# EAGLE design jussi (EAGLE 7.5.0)
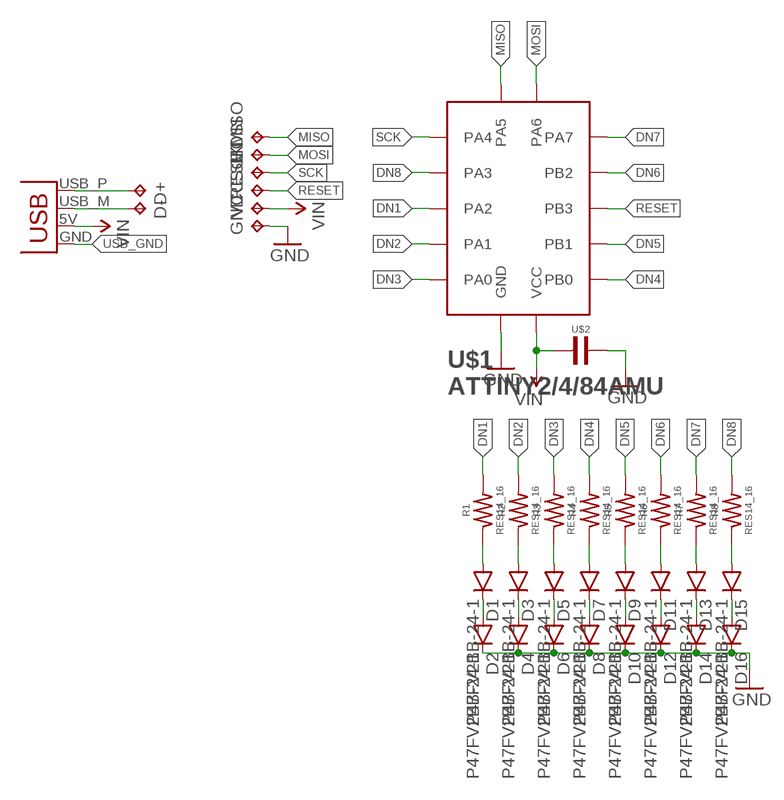
[diagram p0: schematic, sheet 1]

## Parts
D1  P47FV2BB-24-1  [P47F]
D2  P47FV2BB-24-1  [P47F]
D3  P47FV2BB-24-1  [P47F]
D4  P47FV2BB-24-1  [P47F]
D5  P47FV2BB-24-1  [P47F]
D6  P47FV2BB-24-1  [P47F]
D7  P47FV2BB-24-1  [P47F]
D8  P47FV2BB-24-1  [P47F]
D9  P47FV2BB-24-1  [P47F]
D10  P47FV2BB-24-1  [P47F]
D11  P47FV2BB-24-1  [P47F]
D12  P47FV2BB-24-1  [P47F]
D13  P47FV2BB-24-1  [P47F]
D14  P47FV2BB-24-1  [P47F]
D15  P47FV2BB-24-1  [P47F]
D16  P47FV2BB-24-1  [P47F]
D+  TPTP08R  [TP08R]
D-  TPTP08R  [TP08R]
GND  TPTP08R  [TP08R]
JP1  USBPCB  [USB-A-PCB]
MISO  TPTP08R  [TP08R]
MOSI  TPTP08R  [TP08R]
R1  RES14_16  [0402]
R2  RES14_16  [0402]
R3  RES14_16  [0402]
R4  RES14_16  [0402]
R5  RES14_16  [0402]
R6  RES14_16  [0402]
R7  RES14_16  [0402]
R8  RES14_16  [0402]
RESET  TPTP08R  [TP08R]
SCK  TPTP08R  [TP08R]
U$1  ATTINY2/4/84AMU  [20-WFQFN]
U$2  CAP47UF_10V  [0805]
VCC  TPTP08R  [TP08R]

## Nets
D+: D+.TP JP1.USB_P(D+)
D-: D-.TP JP1.USB_M(D-)
DN1: R1.2 U$1.3(PA2)
DN2: R2.2 U$1.4(PA1)
DN3: R3.2 U$1.5(PA0)
DN4: R4.2 U$1.11(PB0)
DN5: R5.2 U$1.12(PB1)
DN6: R6.2 U$1.14(PB2)
DN7: R7.2 U$1.15(PA7)
DN8: R8.2 U$1.2(PA3)
GND: D2.C D4.C D6.C D8.C D10.C D12.C D14.C D16.C GND.TP U$1.8(GND) U$1.PAD(GND) U$2.2
MISO: MISO.TP U$1.20(PA5)
MOSI: MOSI.TP U$1.16(PA6)
N$1: D1.C D2.A
N$2: D3.C D4.A
N$3: D5.C D6.A
N$4: D7.C D8.A
N$5: D9.C D10.A
N$6: D11.C D12.A
N$7: D13.C D14.A
N$8: D15.C D16.A
N$9: D1.A R1.1
N$10: D3.A R2.1
N$11: D5.A R3.1
N$12: D7.A R4.1
N$13: D9.A R5.1
N$14: D11.A R6.1
N$15: D13.A R7.1
N$16: D15.A R8.1
RESET: RESET.TP U$1.13(PB3)
SCK: SCK.TP U$1.1(PA4)
USB_GND: JP1.GND
VIN: JP1.5V(VBUS) U$1.9(VCC) U$2.1 VCC.TP

## Library data of the parts
D1-D16 = pcb-card:P47F: PointLED® Enhanced Thinfilm LED; DIGIKEY_PART_#: 475-1301-1-ND; EURO: 7.74/25; MANUFACTURER: OSRAM Opto Semiconductors Inc.; MFG_PART_#: LA P47F-V2BB-24-3A4B-Z
D+ D- GND MISO MOSI RESET SCK VCC = testpad:TP: Test pad
JP1 = SparkFun-Connectors:USB: USB Connectors USB-B-PTH is fully proven SKU : PRT-00139/CONN-08278 USB-miniB is fully proven SKU : PRT-00587 USB-A-PCB is untested. USB-A-H is throughly reviewed, but untested. Spark Fun Electronics SKU : PRT-00437 USB-B-SMT is throughly reviewed, but untested. Needs silkscreen touching up. USB-A-S has not been used/tested USB-MB-H has not been used/tested USB-MICROB has been used. CONN-09505
R1-R8 = dubec:RES: Resistor; DIGIKEY_PART_#: 541-14.0LCT-ND; EURO: 2.09/50; MANUFACTURER: Vishay Dale; MFG_PART_#: CRCW040214R0FKED; TEMP: ±100ppm/°C; TOLERANCE: ±1%
U$1 = pcb-card:ATTINY2/4/84A: ATtiny24A/44A/84A; DIGIKEY_PART_#: ATTINY24A-MU-ND; EURO: 12.11/10; MANUFACTURER: Atmel; MFG_PART_#: ATTINY24A-MU
U$2 = dubec:CAP: Ceramic capacitor; DIGIKEY_PART_#: 445-8239-1-ND; MANUFACTURER: TDK Corporation; MFG_PART_#: C2012X5R1A476M125AC; TEMP: X5R; TOLERANCE: ±20%; USD: 0.93

## Board
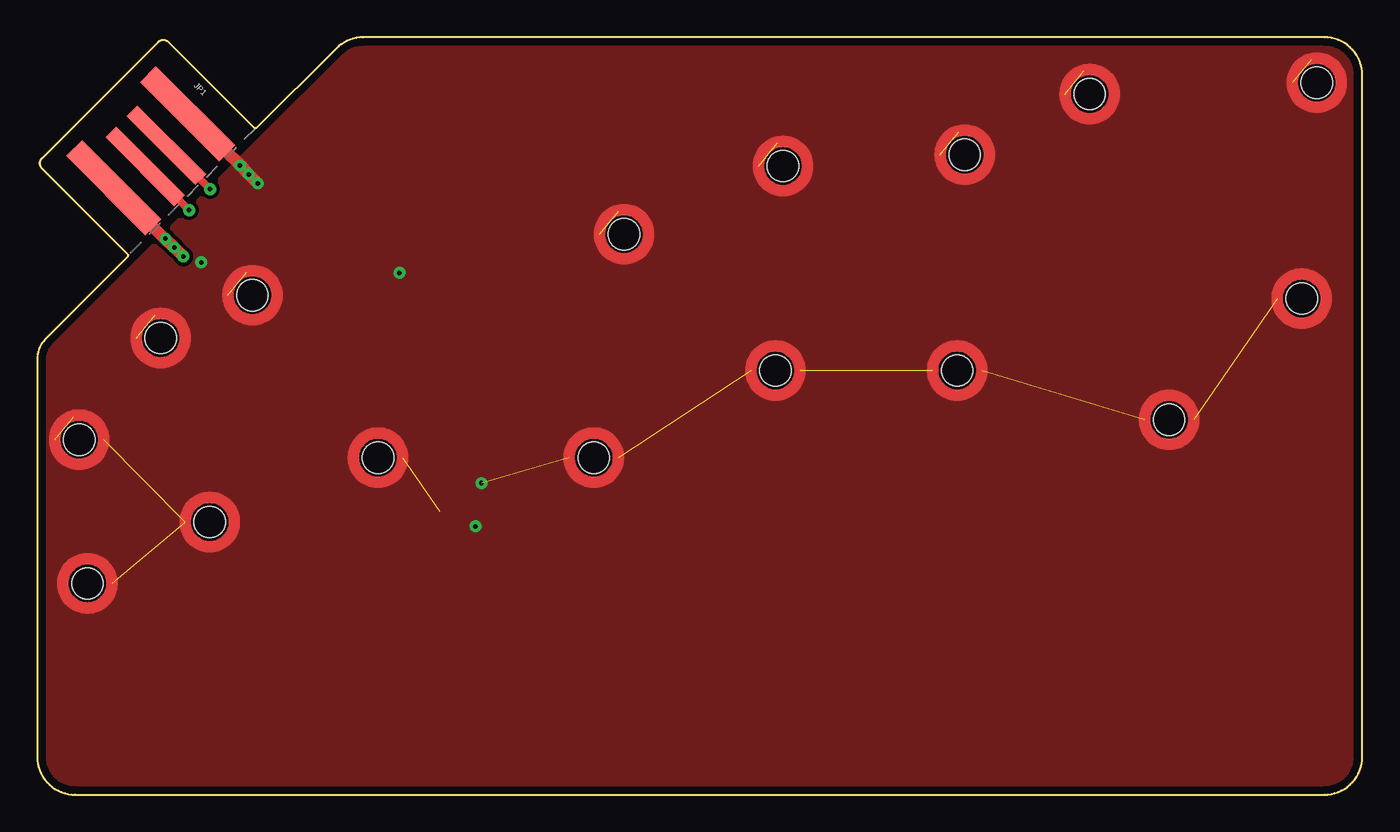
[diagram p1: board, top side]
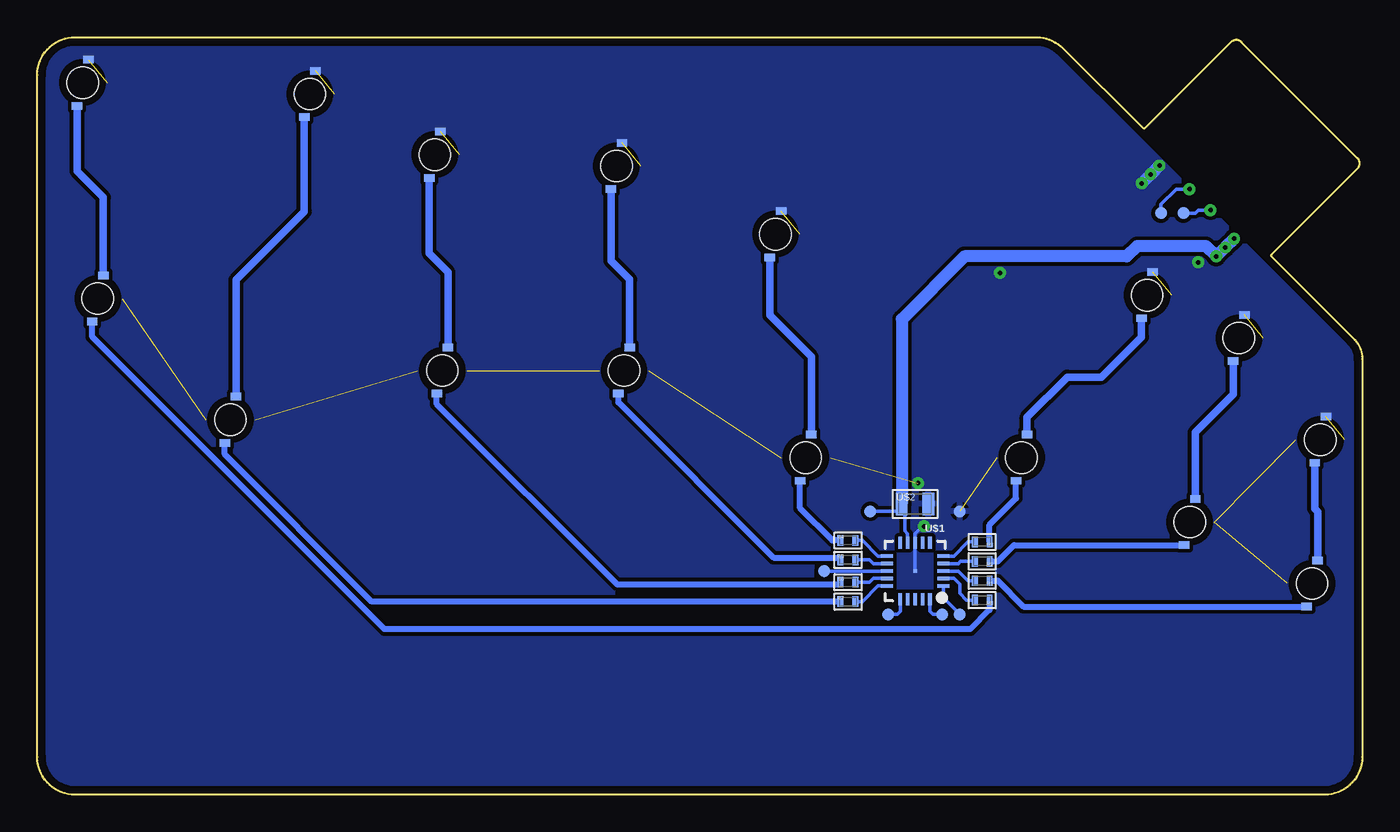
[diagram p2: board, bottom side, seen from below]

Size 88.9 x 50.8 mm. Coordinates in mm from the lower left corner, seen from the top.
Outline: 6.1,36.2 6.1,36.1 0.51,30.51 arc45 0,29.24 0,2.54 arc90 2.54,0 86.36,0 arc90 88.9,2.54 88.9,48.26 arc90 86.36,50.8 21.84,50.8 arc45 20.07,50.04 14.7,44.7 14.6,44.7
Copper layers (1*16): Top 0.035mm / dielectric 1.5mm / Bottom 0.035mm
Design rules "default *": minimum track width 0.25mm, minimum drill 0.3mm, track to track 0.25mm, track to pad 0.25mm, pad to pad 0.25mm, via to via 0.25mm, smd to smd 0.25mm, copper to edge 20mil, drill to drill 18mil, minimum pad ring 0.25mm, minimum via ring 0.25mm, stop-mask expansion 4mil, vias tented up to drill 2mm, thermal gap 0.25mm
tRestrict: 1 lines
bRestrict: 1 lines

### Footprints (pad centres in the part's own frame; a part is rotated, then mirrored left to right if it is on the bottom)
P47F = smd 0.5 x 0.7 bottom: A 1.55,0.375; C -1.55,-0.375 | hole 2.1: 0,0
TP08R = smd 0.8 x 0.8: TP 0,0
USB-A-PCB = smd 7.5 x 1.5: 5V -0.2,-3.5; GND -0.2,3.5 | smd 6.5 x 1: USB_M 0.3,-1; USB_P 0.3,1
0402 = smd 0.4 x 0.7: 1 -0.5,0; 2 0.5,0
20-WFQFN = smd 0.8 x 0.25: 1 -1.9,1; 2 -1.9,0.5; 3 -1.9,0; 4 -1.9,-0.5; 5 -1.9,-1; 11 1.9,-1; 12 1.9,-0.5; 13 1.9,0; 14 1.9,0.5; 15 1.9,1 | smd 0.25 x 0.8: 6 -1,-1.9; 7 -0.5,-1.9; 8 0,-1.9; 9 0.5,-1.9; 10 1,-1.9; 16 1,1.9; 17 0.5,1.9; 18 0,1.9; 19 -0.5,1.9; 20 -1,1.9 | smd 0.25 x 0.25: PAD 0,0
0805 = smd 0.8 x 1.5: 1 -0.9,0; 2 0.9,0

### Placement (x,y rotation side)
D1  3.36,14.17 270 top
D2  2.81,23.81 270 top
D3  11.58,18.29 270 top
D4  8.28,30.63 270 top
D5  22.86,22.61 270 top
D6  14.44,33.5 270 top
D7  37.34,22.61 270 top
D8  39.37,37.59 270 top
D9  49.53,28.45 270 top
D10  50.04,42.16 270 top
D11  61.72,28.45 270 top
D12  62.23,42.93 270 top
D13  75.95,25.15 270 top
D14  70.61,46.99 270 top
D15  84.84,33.27 270 top
D16  85.85,47.75 270 top
D+  13.5,39 0 bottom
D-  12,39 0 bottom
GND  27,19 0 bottom
JP1  7.75,43.05 315 top
MISO  28.2,12.1 0 bottom
MOSI  31.8,12.1 0 bottom
R1  25.5,14.35 180 bottom
R2  25.5,15.65 180 bottom
R3  25.5,16.95 180 bottom
R4  34.5,17.05 0 bottom
R5  34.5,15.75 0 bottom
R6  34.5,14.25 0 bottom
R7  34.5,12.95 0 bottom
R8  25.5,13.05 180 bottom
RESET  36.1,15 0 bottom
SCK  27,12.1 0 bottom
U$1  30,15 180 bottom
U$2  30,19.5 0 bottom
VCC  33,19 0 bottom

### Tracks (layer width: path | path; a pad name or v marks a point on that pad's centre or on a via)
D+  (via drill 0.3)
  Top 0.5: JP1.USB_P v11.6,40.61
  Bottom 0.25: v11.6,40.61 12.49,40.61 13.5,39.6 D+.TP
D-  (via drill 0.3)
  Top 0.5: JP1.USB_M v10.19,39.2
  Bottom 0.25: v10.19,39.2 11,39.2 11.2,39 D-.TP
DN1
  Bottom 0.25: U$1.3 27.1,15 26.45,14.35 R1.2
DN2
  Bottom 0.25: U$1.4 27.1,15.5 26.95,15.65 R2.2
DN3
  Bottom 0.25: U$1.5 27.4,16 26.45,16.95 R3.2
DN4
  Bottom 0.25: U$1.11 32.5,16 33.55,17.05 R4.2
DN5
  Bottom 0.25: U$1.12 32.8,15.5 33.05,15.75 R5.2
DN6
  Bottom 0.25: U$1.14 32.8,14.5 33.05,14.25 R6.2
DN7
  Bottom 0.25: U$1.15 32.5,14 33.55,12.95 R7.2
DN8
  Bottom 0.25: U$1.2 27.4,14.5 27,14.1 27,13.5 26.55,13.05 R8.2
GND  (via drill 0.3)  (16 unrouted)
  Top 0.762: 12.79,33.5 arc-180 16.09,33.5 arc-180 12.79,33.5 | 6.63,30.63 arc-180 9.93,30.63 arc-180 6.63,30.63 | 21.21,22.61 arc-180 24.51,22.61 arc-180 21.21,22.61 | 9.93,18.29 arc-180 13.23,18.29 arc-180 9.93,18.29 | 1.16,23.81 arc-180 4.46,23.81 arc-180 1.16,23.81 | 1.71,14.17 arc-180 5.01,14.17 arc-180 1.71,14.17 | 35.69,22.61 arc-180 38.99,22.61 arc-180 35.69,22.61 | 37.72,37.59 arc-180 41.02,37.59 arc-180 37.72,37.59 | 48.39,42.16 arc-180 51.69,42.16 arc-180 48.39,42.16 | 47.88,28.45 arc-180 51.18,28.45 arc-180 47.88,28.45 | 60.58,42.93 arc-180 63.88,42.93 arc-180 60.58,42.93 | 60.07,28.45 arc-180 63.37,28.45 arc-180 60.07,28.45 | 74.3,25.15 arc-180 77.6,25.15 arc-180 74.3,25.15 | 83.19,33.27 arc-180 86.49,33.27 arc-180 83.19,33.27 | 68.96,46.99 arc-180 72.26,46.99 arc-180 68.96,46.99 | 84.2,47.75 arc-180 87.5,47.75 arc-180 84.2,47.75
  Top 0.8: 12.6,43.2 v13.6,42.2 v14.2,41.6 v14.8,41
  Bottom 0.25: U$1.PAD U$1.8 30,17.5 29.5,18 v29.4,18
  Bottom 0.8: v13.6,42.2 v14.2,41.6 v14.8,41
  other vias: 11,35.7 24.3,35 29.8,20.9
  pour Top: 0,0 0,50.8 88.9,50.8 88.9,0
  pour Bottom: 0,0 0,52 90,52 90,0
MISO
  Bottom 0.25: MISO.TP 28.8,12.1 29,12.3 U$1.20
MOSI
  Bottom 0.25: MOSI.TP 31.2,12.1 31,12.3 U$1.16
N$1
  Bottom 0.5: D1.C 2.99,18.99 3.19,19.18 D2.A
N$2
  Bottom 0.5: D3.C 11.2,24.3 8.65,26.85 D4.A
N$3
  Bottom 0.5: D5.C 22.48,25.32 19.8,28 17.5,28 14.81,30.68 D6.A
N$4
  Bottom 0.5: D7.C 36.96,29.36 39.74,32.15 D8.A
N$5
  Bottom 0.5: D9.C 49.16,34.55 50.41,35.81 D10.A
N$6
  Bottom 0.5: D11.C 61.35,35.05 62.6,36.3 D12.A
N$7
  Bottom 0.5: D13.C 75.57,34.53 70.99,39.11 D14.A
N$8
  Bottom 0.5: D15.C 84.46,40.06 86.23,41.83 D16.A
N$9
  Bottom 0.4: R1.1 24.45,14.35 22.72,12.62 D1.A
N$10
  Bottom 0.4: R2.1 24.45,15.65 23.36,16.74 D3.A
N$11
  Bottom 0.4: R3.1 25,18.1 23.23,19.86 D5.A
N$12
  Bottom 0.4: R4.1 35.55,17.05 37.71,19.21 D7.A
N$13
  Bottom 0.4: D9.A 49.91,26.3 39.5,15.9 35.15,15.9 R5.1
N$14
  Bottom 0.4: D11.A 62.1,26.2 50,14.1 35.15,14.1 R6.1
N$15
  Bottom 0.4: D13.A 76.32,22.82 66.45,12.95 R7.1
N$16
  Bottom 0.4: D15.A 85.21,30.71 65.6,11.1 26.3,11.1 25,12.4 R8.1
RESET
  Bottom 0.25: U$1.13 RESET.TP
SCK
  Bottom 0.25: SCK.TP 28.1,13.2 U$1.1
VIN  (via drill 0.3)
  Top 0.8: JP1.5V 8.55,37.3 v8.6,37.3 v9.2,36.7 v9.8,36.1
  Bottom 0.25: U$1.9 30.5,17.5 30.7,17.7 30.7,19.3 U$2.1 30.9,19 VCC.TP
  Bottom 0.8: v8.6,37.3 v9.2,36.7 v9.8,36.1 10.5,36.8 15.1,36.8 15.8,36.1 26.7,36.1 30.9,31.9 U$2.1